# EAGLE design SENSORES (EAGLE 9.6.2)
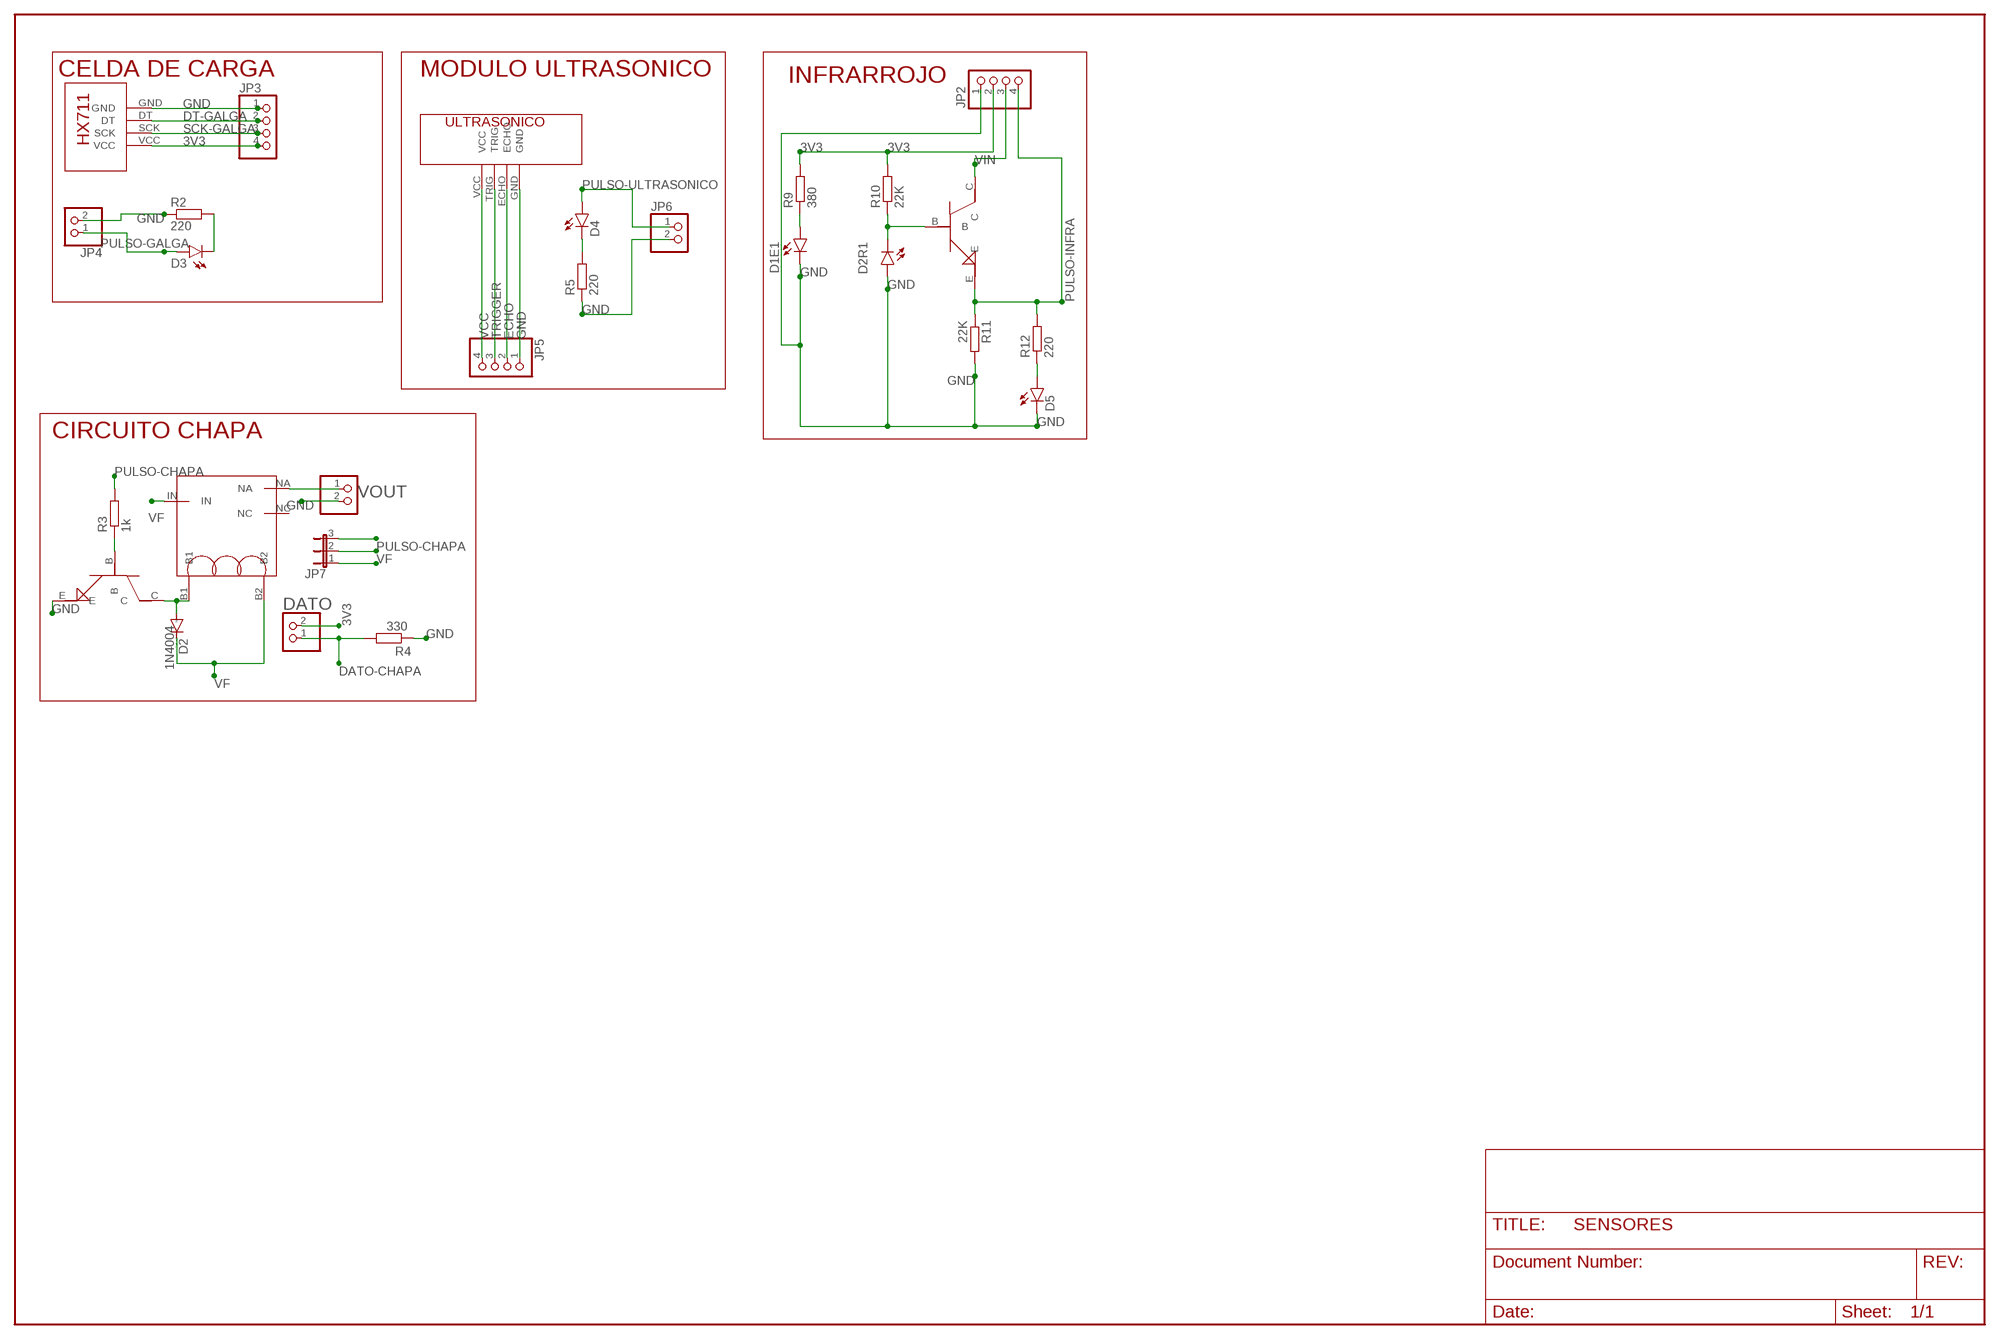
[diagram p0: schematic, sheet 1]

## Parts
D1E1  LED3MM  [LED3MM]
D2  1N4004  [DO41-10]
D2R1  LED3MM  [LED3MM]
D3  LED3MM  [LED3MM]
D4  LED3MM  [LED3MM]
D5  LED3MM  [LED3MM]
DATO  PINHD-1X2  [1X02]
JP2  PINHD-1X4  [1X04]
JP3  PINHD-1X4  [1X04]
JP4  PINHD-1X2  [1X02]
JP5  PINHD-1X4  [1X04]
JP6  PINHD-1X2  [1X02]
JP7  JP2E  [JP2]
R2  220  R-EU_0204/7  [0204/7]
R3  1k  R-EU_0204/7  [0204/7]
R4  330  R-EU_0204/7  [0204/7]
R5  220  R-EU_0204/7  [0204/7]
R9  380  R-EU_0204/7  [0204/7]
R10  22K  R-EU_0204/7  [0204/7]
R11  22K  R-EU_0204/7  [0204/7]
R12  220  R-EU_0204/7  [0204/7]
U$1  HX-711  [HX-711]
U$2  2N2222  [2N2222]
U$3  ULTRASONICO  [ULTRASONICO]
U$5  2N2222  [2N2222]
U$7  RELEY  [RELEY]
VOUT  PINHD-1X2  [1X02]

## Nets
3V3: DATO.2 JP2.2 JP3.4 R9.2 R10.2 U$1.VCC
DATO-CHAPA: DATO.1 R4.2
DT-GALGA: JP3.2 U$1.DT
ECHO: JP5.2 U$3.ECHO
GND: D1E1.K(C) D2R1.A D5.K(C) JP2.1 JP3.1 JP4.2 JP5.1 JP6.2 JP7.3 R2.1 R4.1 R5.1 R11.2 U$1.GND U$3.GND U$5.E VOUT.2
N$1: D3.K(C) R2.2
N$2: D1E1.A R9.1
N$3: D4.K(C) R5.2
N$4: D2R1.K(C) R10.1 U$2.B
N$5: D5.A R12.1
N$10: R3.1 U$5.B
N$11: D2.A U$5.C U$7.B1
N$12: U$7.NA VOUT.1
PULSO-CHAPA: JP7.2 R3.2
PULSO-GALGA: D3.A JP4.1
PULSO-INFRA: JP2.4 R11.1 R12.2 U$2.E
PULSO-ULTRASONICO: D4.A JP6.1
SCK-GALGA: JP3.3 U$1.SCK
TRIGGER: JP5.3 U$3.TRIG
VCC: JP5.4 U$3.VCC
VF: D2.C JP7.1 U$7.B2 U$7.IN
VIN: JP2.3 U$2.C
Unconnected: U$7.NC

## Notes on the sheet
- CELDA DE CARGA | MODULO ULTRASONICO | INFRARROJO
- CIRCUITO CHAPA

## Library data of the parts
D1E1 D2R1 D3-D5 = led:LED: LED OSRAM: - CHIPLED LG R971, LG N971, LY N971, LG Q971, LY Q971, LO R971, LY R971 LH N974, LH R974 LS Q976, LO Q976, LY Q976 LO Q996 - Hyper CHIPLED LW Q18S LB Q993, LB Q99A, LB R99A - SideLED LS A670, LO A670, LY A670, LG A670, LP A670 LB A673, LV A673, LT A673, LW A673 LH A674 LY A675 LS A676, LA A676, LO A676, LY A676, LW A676 LS A679, LY A679, LG A679 - Hyper Micro SIDELED® LS Y876, LA Y876, LO Y876, LY Y876 LT Y87S - SmartLED LW L88C, LW L88S LB L89C, LB L89S, LG L890 LS L89K, LO L89K, LY L89K LS L896, LA L896, LO L896, LY L896 - TOPLED LS T670, LO T670, LY T670, LG T670, LP T670 LSG T670, LSP T670, LSY T670, LOP T670, LYG T670 LG T671, LOG T671, LSG T671 LB T673, LV T673, LT T673, LW T673 LH T674 LS T676, LA T676, LO T676, LY T676, LB T676, LH T676, LSB T676, LW T676 LB T67C, LV T67C, LT T67C, LS T67K, LO T67K, LY T67K, LW E67C LS E67B, LA E67B, LO E67B, LY E67B, LB E67C, LV E67C, LT E67C LW T67C LS T679, LY T679, LG T679 LS T770, LO T770, LY T770, LG T770, LP T770 LB T773, LV T773, LT T773, LW T773 LH T774 LS E675, LA E675, LY E675, LS T675 LS T776, LA T776, LO T776, LY T776, LB T776 LHGB T686 LT T68C, LB T68C - Hyper Mini TOPLED® LB M676 - Mini TOPLED Santana® LG M470 LS M47K, LO M47K, LY M47K Source: http://www.osram.convergy.de LUXEON: - LUMILED® LXK2-PW12-R00, LXK2-PW12-S00, LXK2-PW14-U00, LXK2-PW14-V00 LXK2-PM12-R00, LXK2-PM12-S00, LXK2-PM14-U00 LXK2-PE12-Q00, LXK2-PE12-R00, LXK2-PE12-S00, LXK2-PE14-T00, LXK2-PE14-U00 LXK2-PB12-K00, LXK2-PB12-L00, LXK2-PB12-M00, LXK2-PB14-N00, LXK2-PB14-P00, LXK2-PB14-Q00 LXK2-PR12-L00, LXK2-PR12-M00, LXK2-PR14-Q00, LXK2-PR14-R00 LXK2-PD12-Q00, LXK2-PD12-R00, LXK2-PD12-S00 LXK2-PH12-R00, LXK2-PH12-S00 LXK2-PL12-P00, LXK2-PL12-Q00, LXK2-PL12-R00 Source: www.luxeon.com KINGBRIGHT: KA-3528ASYC Source: www.kingbright.com
D2 = diode:1N4004: DIODE general purpose rectifier, 1 A
DATO JP4 JP6 VOUT = pinhead:PINHD-1X2: PIN HEADER
JP2 JP3 JP5 = pinhead:PINHD-1X4: PIN HEADER
JP7 = jumper:JP2E: JUMPER
R2-R5 R9-R12 = rcl:R-EU_: RESISTOR, European symbol; SPICEPREFIX: R
U$1 = MODULAR:HX-711
U$2 U$5 = MODULAR:2N2222
U$3 = MODULAR:ULTRASONICO
U$7 = MODULAR:RELEY

## Board
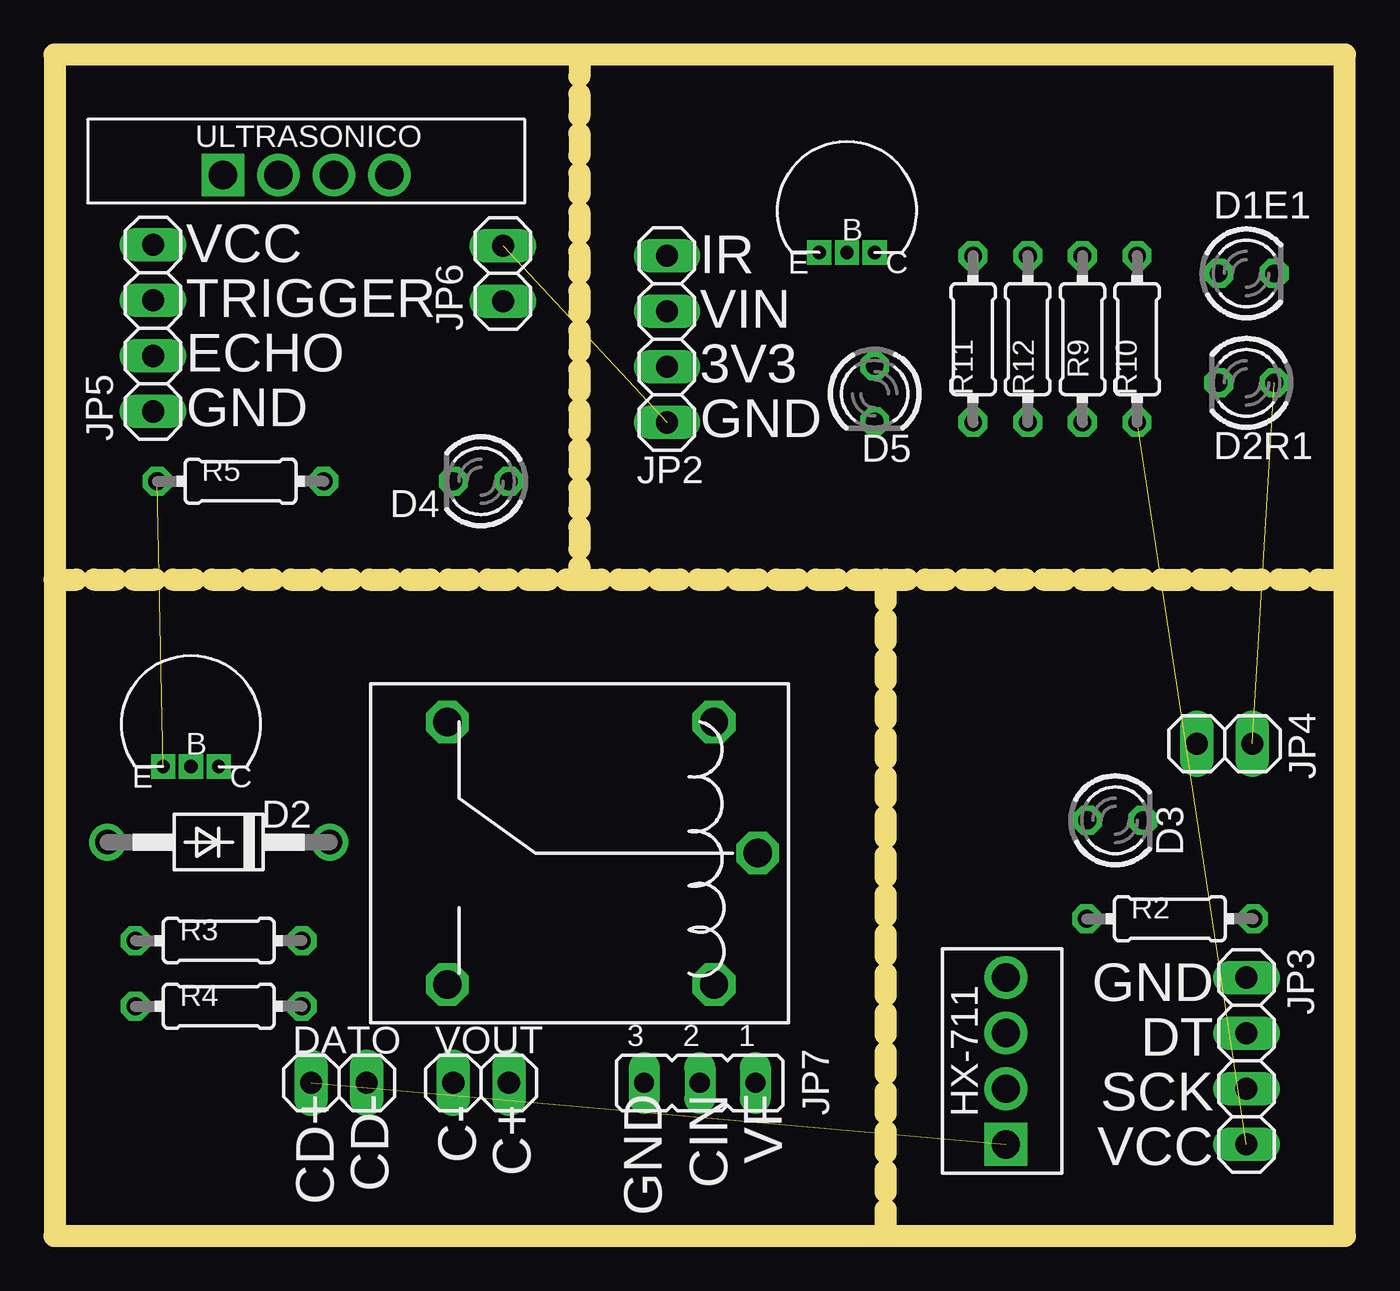
[diagram p1: board, top side]
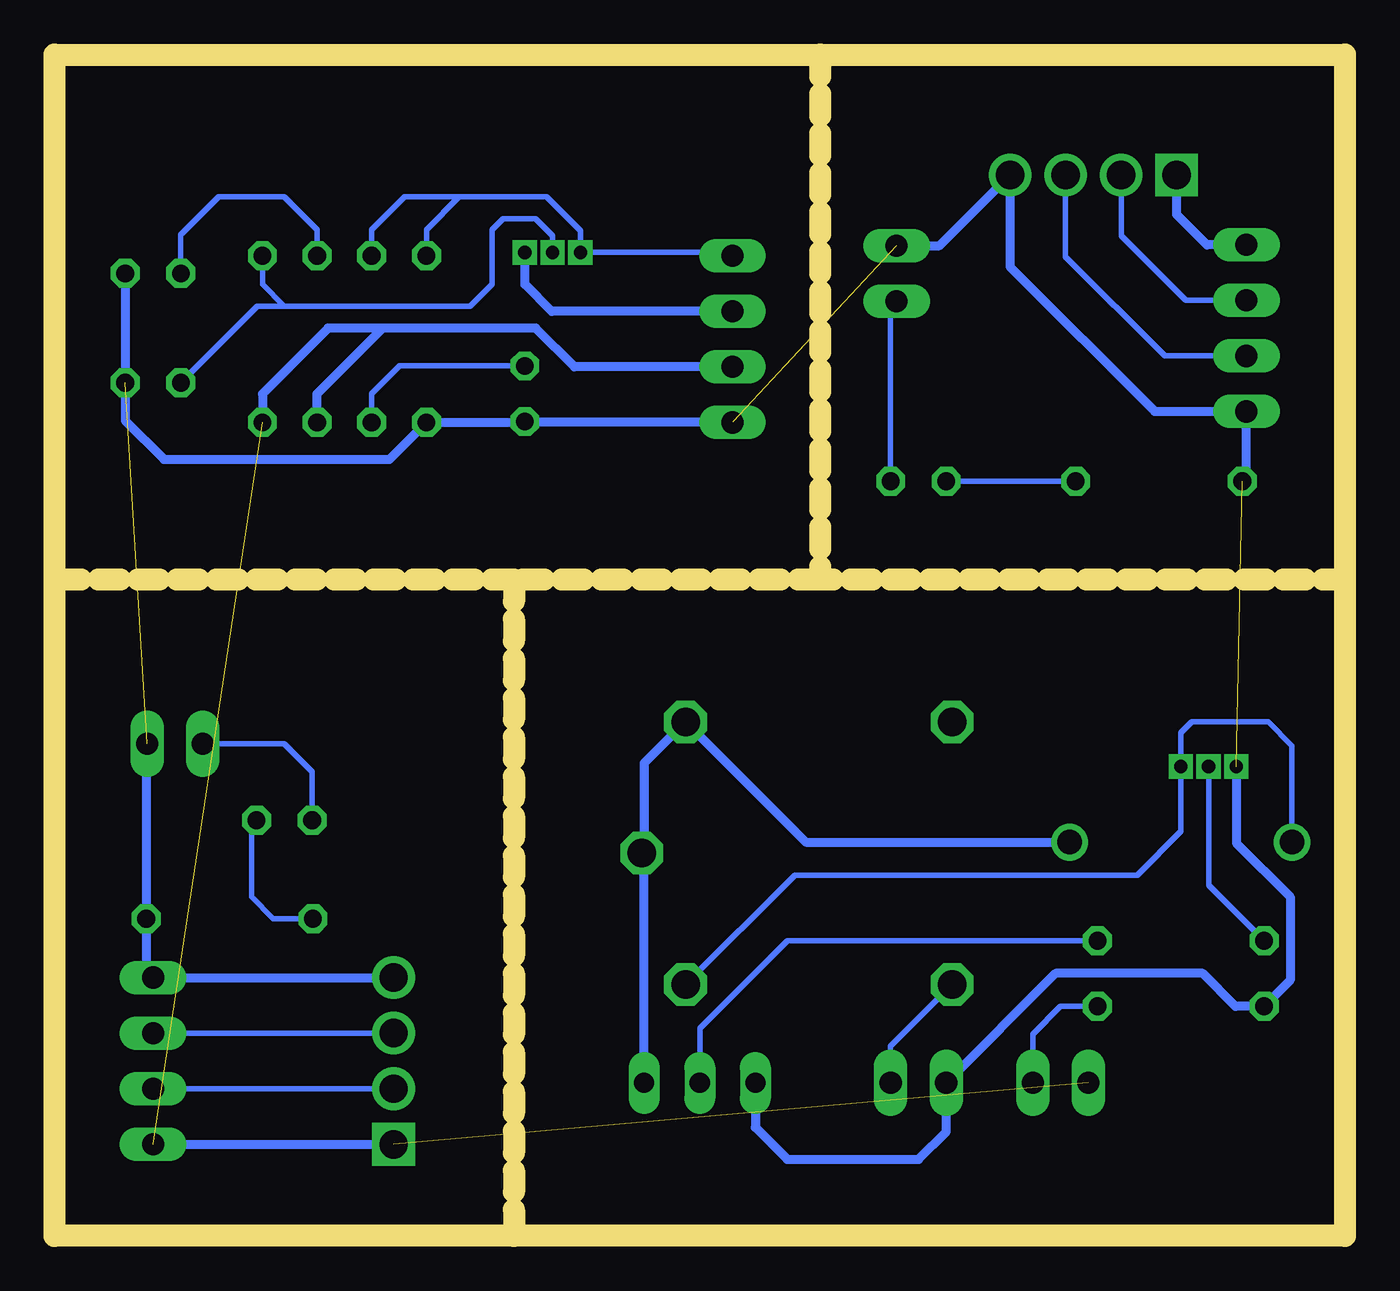
[diagram p2: board, bottom side, seen from below]

Size 59 x 54 mm. Coordinates in mm from the lower left corner, seen from the top.
Outline: 38,0 0,0 0,30
Outline: 38,0 59,0 59,54 0,54 0,30
Outline: 0,30 24,30
Outline: 24,30 38,30
Outline: 38,30 59,30
Outline: 38,30 38,0
Outline: 24,54 24,30
Copper layers (1*16): Top 0.035mm / dielectric 1.5mm / Bottom 0.035mm
Design rules "default": minimum track width 6mil, minimum drill 0.35mm, track to track 6mil, track to pad 6mil, pad to pad 6mil, via to via 6mil, smd to smd 6mil, copper to edge 40mil, drill to drill 6mil, minimum pad ring 10mil, minimum via ring 8mil, stop-mask expansion 4mil, vias tented up to drill 0mil, thermal gap 10mil

### Footprints (pad centres in the part's own frame; a part is rotated, then mirrored left to right if it is on the bottom)
LED3MM = drill 0.813 octagon: A -1.27,0; K 1.27,0
DO41-10 = drill 1.118: A 5.08,0; C -5.08,0
1X02 = drill 1.016 long: 1 -1.27,0; 2 1.27,0
1X04 = drill 1.016 long: 1 -3.81,0; 2 -1.27,0; 3 1.27,0; 4 3.81,0
JP2 = drill 0.914 long: 1 -2.54,0; 2 0,0; 3 2.54,0
0204/7 = drill 0.813 octagon: 1 -3.81,0; 2 3.81,0
HX-711 = drill 1.3: DT 1.27,0; GND 3.81,0; SCK -1.27,0 | drill 1.3 square: VCC -3.81,0
2N2222 = drill 0.6 square: B -2.54,1.27; C -2.54,0; E -2.54,2.54
ULTRASONICO = drill 1.3: ECHO 1.27,0; GND 3.81,0; TRIG -1.27,0 | drill 1.3 square: VCC -3.81,0
RELEY = drill 1.3 octagon: B1 6,6.15; B2 -6,6.15; IN 0,8.15; NA 6,-6.05; NC -6,-6.05

### Placement (x,y rotation side)
D1E1  54.5,44 0 top
D2  7.5,18 180 top
D2R1  54.5,39 180 top
D3  48.5,19 0 top
D4  19.5,34.5 180 top
D5  37.5,38.5 270 top
DATO  13,7 180 top
JP2  28,41 90 top
JP3  54.5,8 270 top
JP4  53.5,22.5 0 top
JP5  4.5,41.5 90 top
JP6  20.5,44 90 top
JP7  29.5,7 180 top
R2  51,14.5 180 top
R3  7.5,13.5 0 top
R4  7.5,10.5 0 top
R5  8.5,34.5 0 top
R9  47,41 270 top
R10  49.5,41 270 top
R11  42,41 270 top
R12  44.5,41 90 top
U$1  43.5,8 90 top
U$2  37.5,47.5 90 top
U$3  11.5,48.5 0 top
U$5  7.5,24 90 top
U$7  24,17.5 270 top
VOUT  19.5,7 180 top

### Tracks (layer width: path | path; a pad name or v marks a point on that pad's centre or on a via)
3V3  (2 unrouted)
  Bottom 0.406: JP3.4 U$1.VCC | JP2.2 35.23,39.73 37,41.5 44,41.5 | 44,41.5 46.5,41.5 49.5,38.5 R10.2 | R9.2 47,38.5 44,41.5
DATO-CHAPA
  Bottom 0.254: DATO.1 14.27,9.23 13,10.5 R4.2
DT-GALGA
  Bottom 0.254: JP3.2 U$1.DT
ECHO
  Bottom 0.254: U$3.ECHO 12.77,44.77 8.23,40.23 JP5.2
GND  (3 unrouted)
  Bottom 0.406: JP7.3 26.96,4.96 25.5,3.5 19.5,3.5 18.23,4.77 VOUT.2 13.23,12 6.5,12 5,10.5 R4.1 2.5,11.69 2.5,15.5 4.96,17.96 U$5.E | U$1.GND JP3.1 54.81,12.12 R2.1 54.81,22.46 JP4.2 | JP6.2 18.54,45.27 U$3.GND 15.31,44.31 8.69,37.69 JP5.1 4.5,34.69 R5.1 | D1E1.K D2R1.A 55.77,37.27 54,35.5 43.69,35.5 R11.2 37.54,37.19 D5.K 28.04,37.23 JP2.1
N$1
  Bottom 0.254: R2.2 49,14.5 50,15.5 50,18.77 D3.K
N$2
  Bottom 0.254: R9.1 47,46 48.5,47.5 51.5,47.5 53.23,45.77 D1E1.A
N$3
  Bottom 0.254: R5.2 D4.K
N$4
  Bottom 0.254: U$2.B 36.23,45.73 37,46.5 38.5,46.5 39,46 39,43.5 40,42.5 48.5,42.5 | 48.5,42.5 49.5,43.5 R10.1 | D2R1.K 49.73,42.5 48.5,42.5
N$5
  Bottom 0.254: D5.A 43.23,39.77 44.5,38.5 R12.1
N$10
  Bottom 0.254: R3.1 6.23,16.04 U$5.B
N$11
  Bottom 0.254: D2.A 2.42,22.42 3.5,23.5 7,23.5 7.5,23 U$5.C 7.5,18.5 9.5,16.5 25.15,16.5 U$7.B1
N$12
  Bottom 0.254: VOUT.1 20.77,8.68 U$7.NA
PULSO-CHAPA
  Bottom 0.254: JP7.2 29.5,9.5 25.5,13.5 R3.2
PULSO-GALGA
  Bottom 0.254: D3.A 47.23,21.23 48.5,22.5 JP4.1
PULSO-INFRA
  Bottom 0.254: JP2.4 28.15,44.96 U$2.E 34.96,45.96 36.5,47.5 40.5,47.5 | 40.5,47.5 43,47.5 44.5,46 R12.2 | R11.1 42,46 40.5,47.5
PULSO-ULTRASONICO
  Bottom 0.254: D4.A 20.77,42.46 JP6.1
SCK-GALGA
  Bottom 0.254: JP3.3 U$1.SCK
TRIGGER
  Bottom 0.254: JP5.3 7.27,42.77 10.23,45.73 U$3.TRIG
VCC
  Bottom 0.406: JP5.4 6.31,45.31 7.69,46.69 U$3.VCC
VF
  Bottom 0.406: JP7.1 32.04,17.39 | 32.04,17.39 U$7.IN | 32.04,17.39 32.04,21.61 U$7.B2 24.65,18 D2.C
VIN
  Bottom 0.406: JP2.3 36.27,42.27 37.5,43.5 U$2.C

### Text on the board
tPlace: B | E | VCC | IR | C | TRIGGER | VIN | ECHO | 3V3 | GND | GND | E | B | C | GND | DT | SCK | CD+ | CD- | C- | C+ | GND | CIN | VF | VCC